# EAGLE schematic fyp (EAGLE 8.2.0)
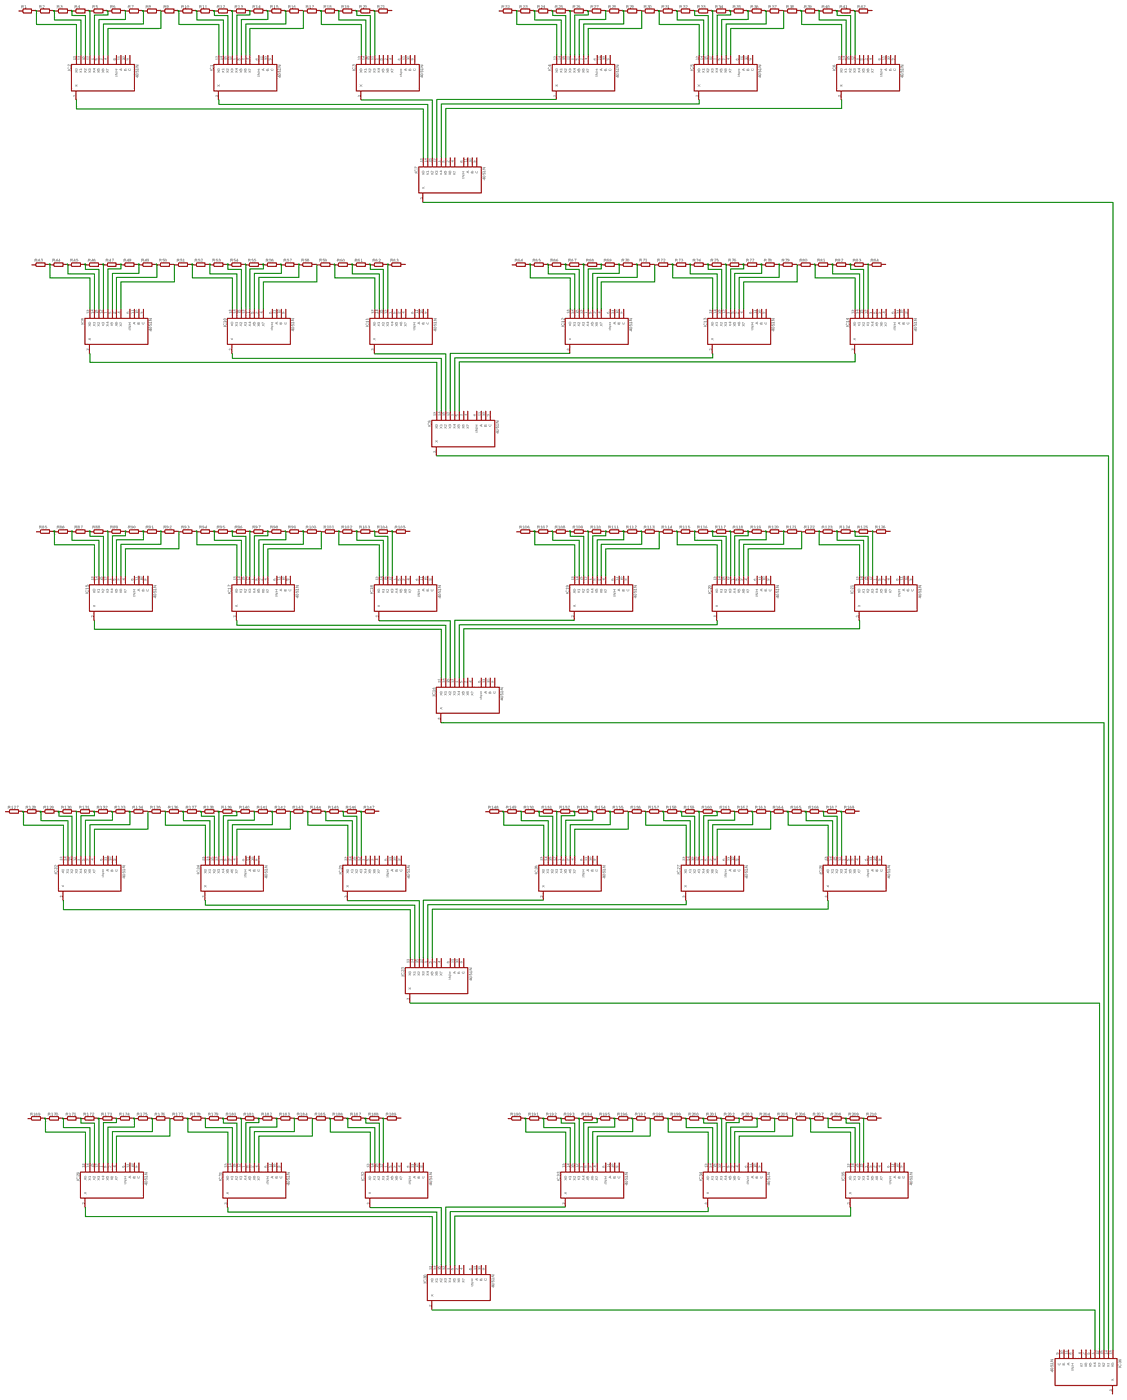
[diagram p0: schematic, sheet 1, overview]
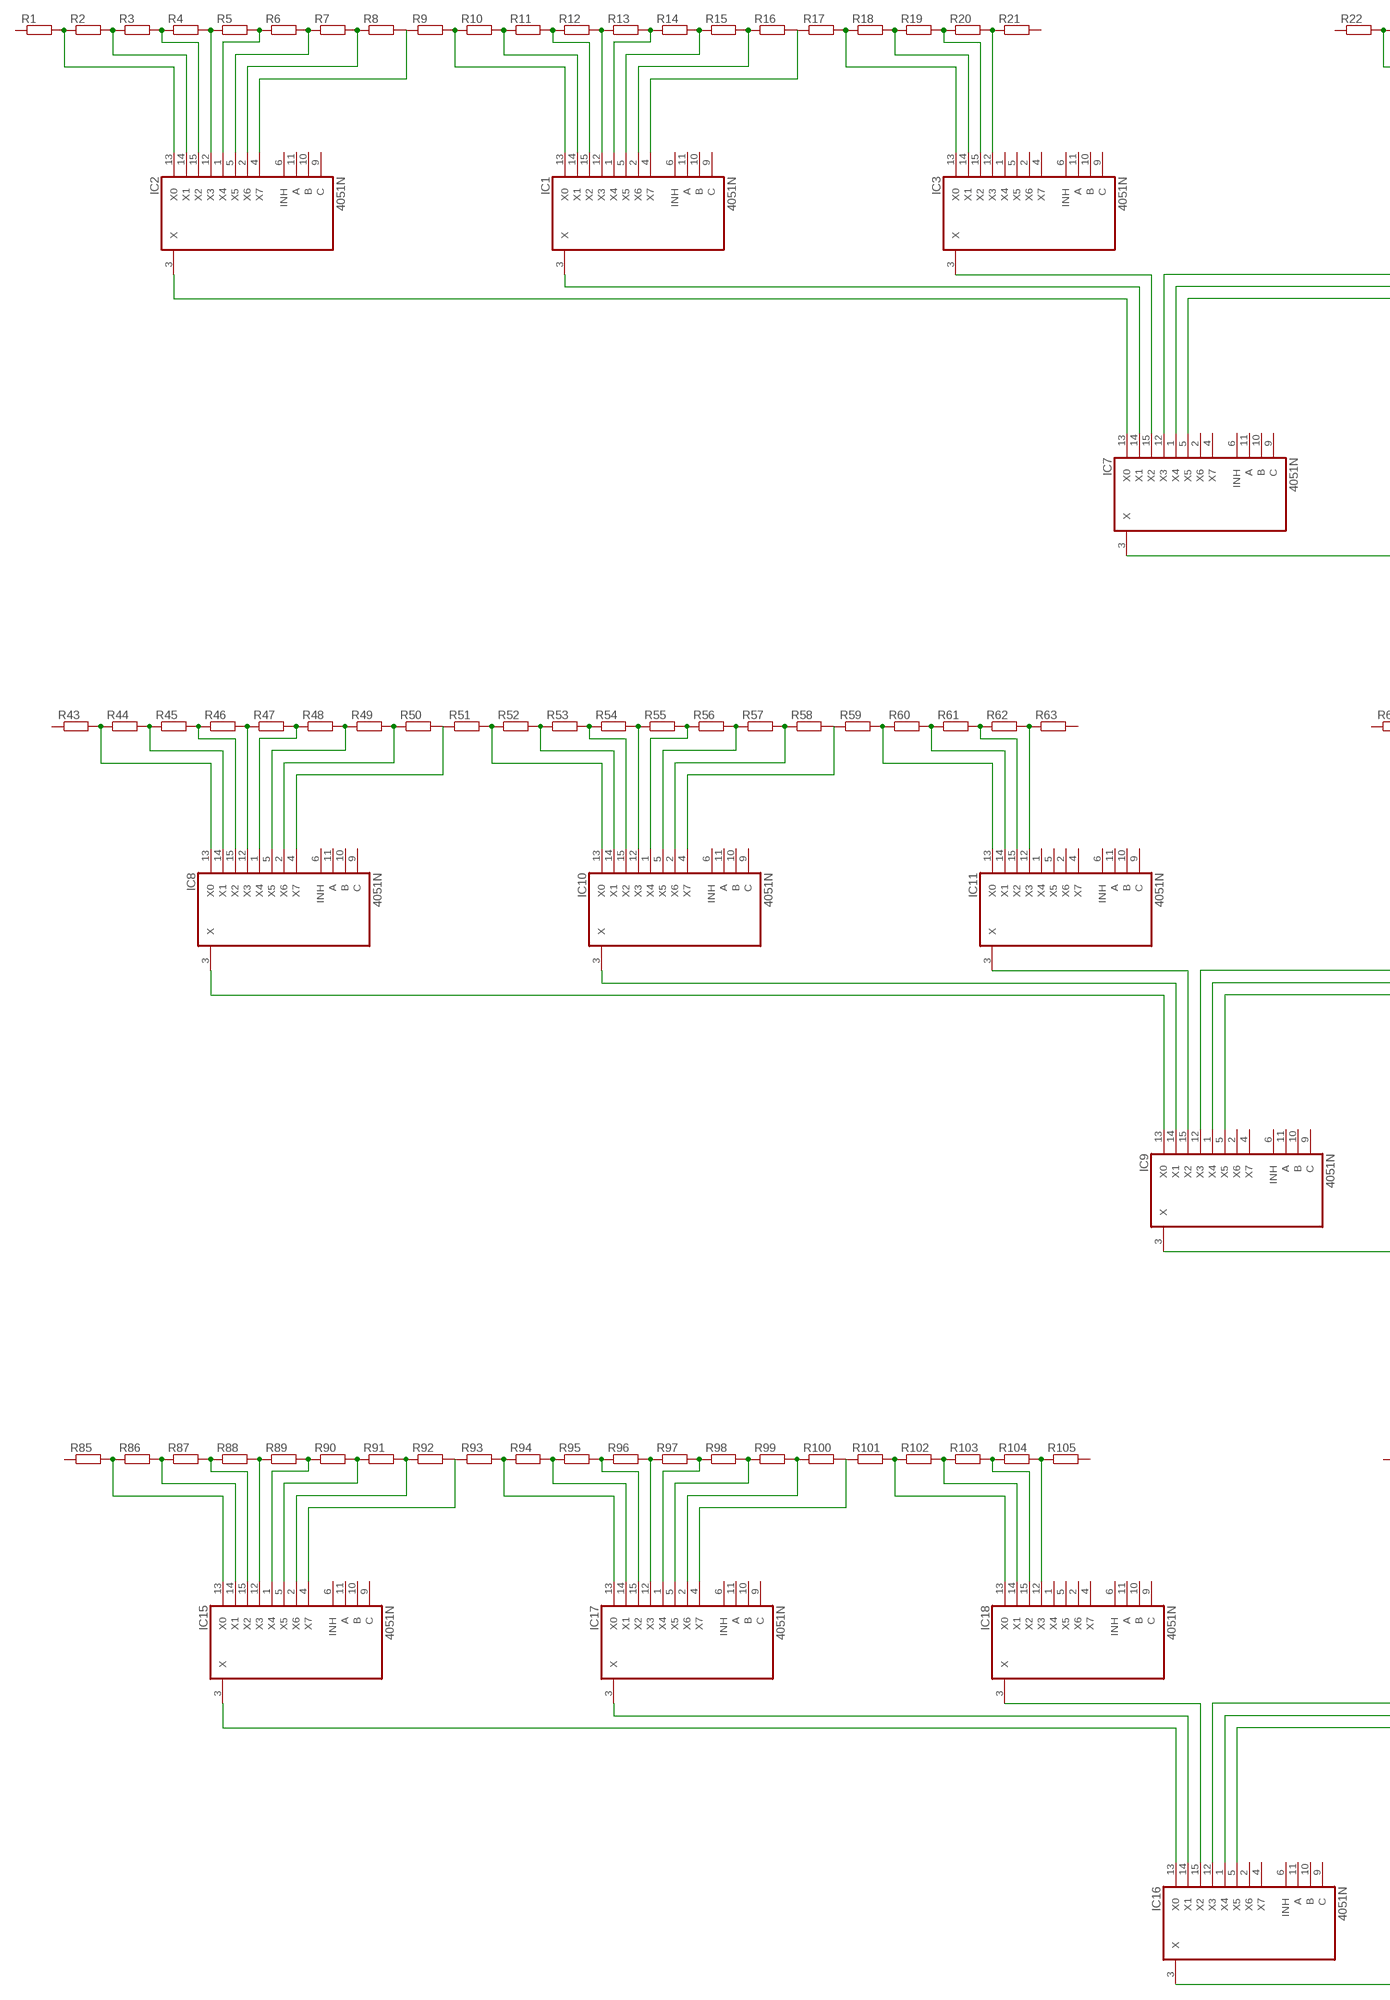
[diagram p1: schematic, sheet 1, part 1 of 4]
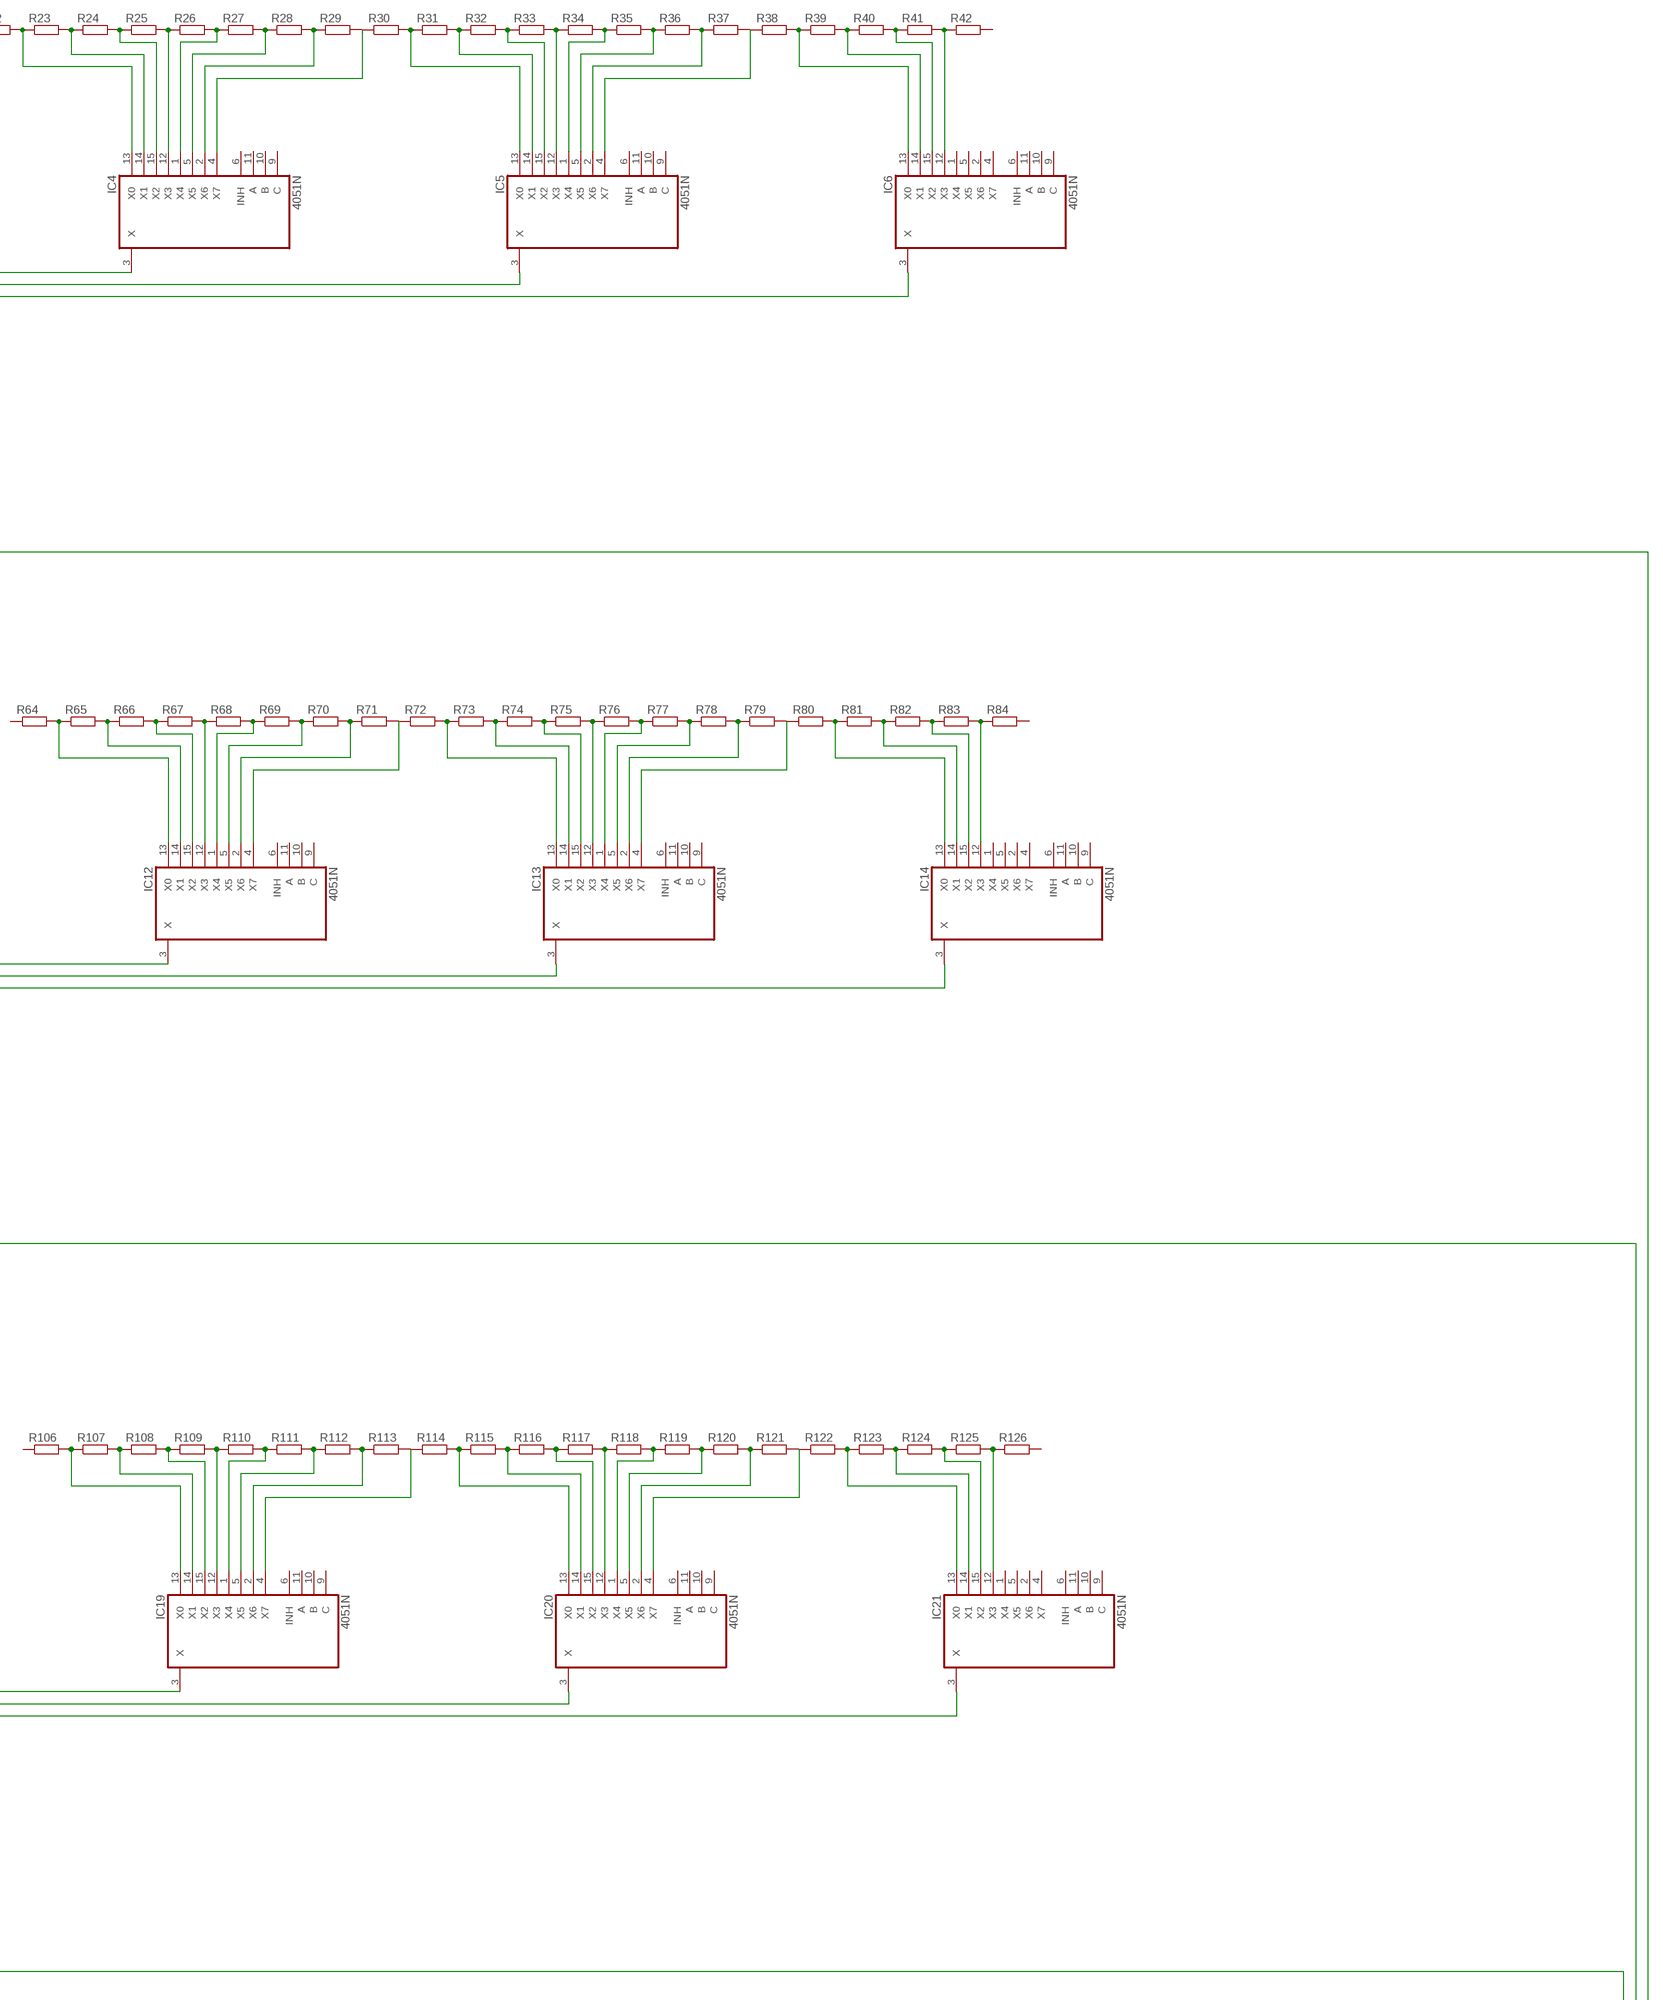
[diagram p2: schematic, sheet 1, part 2 of 4]
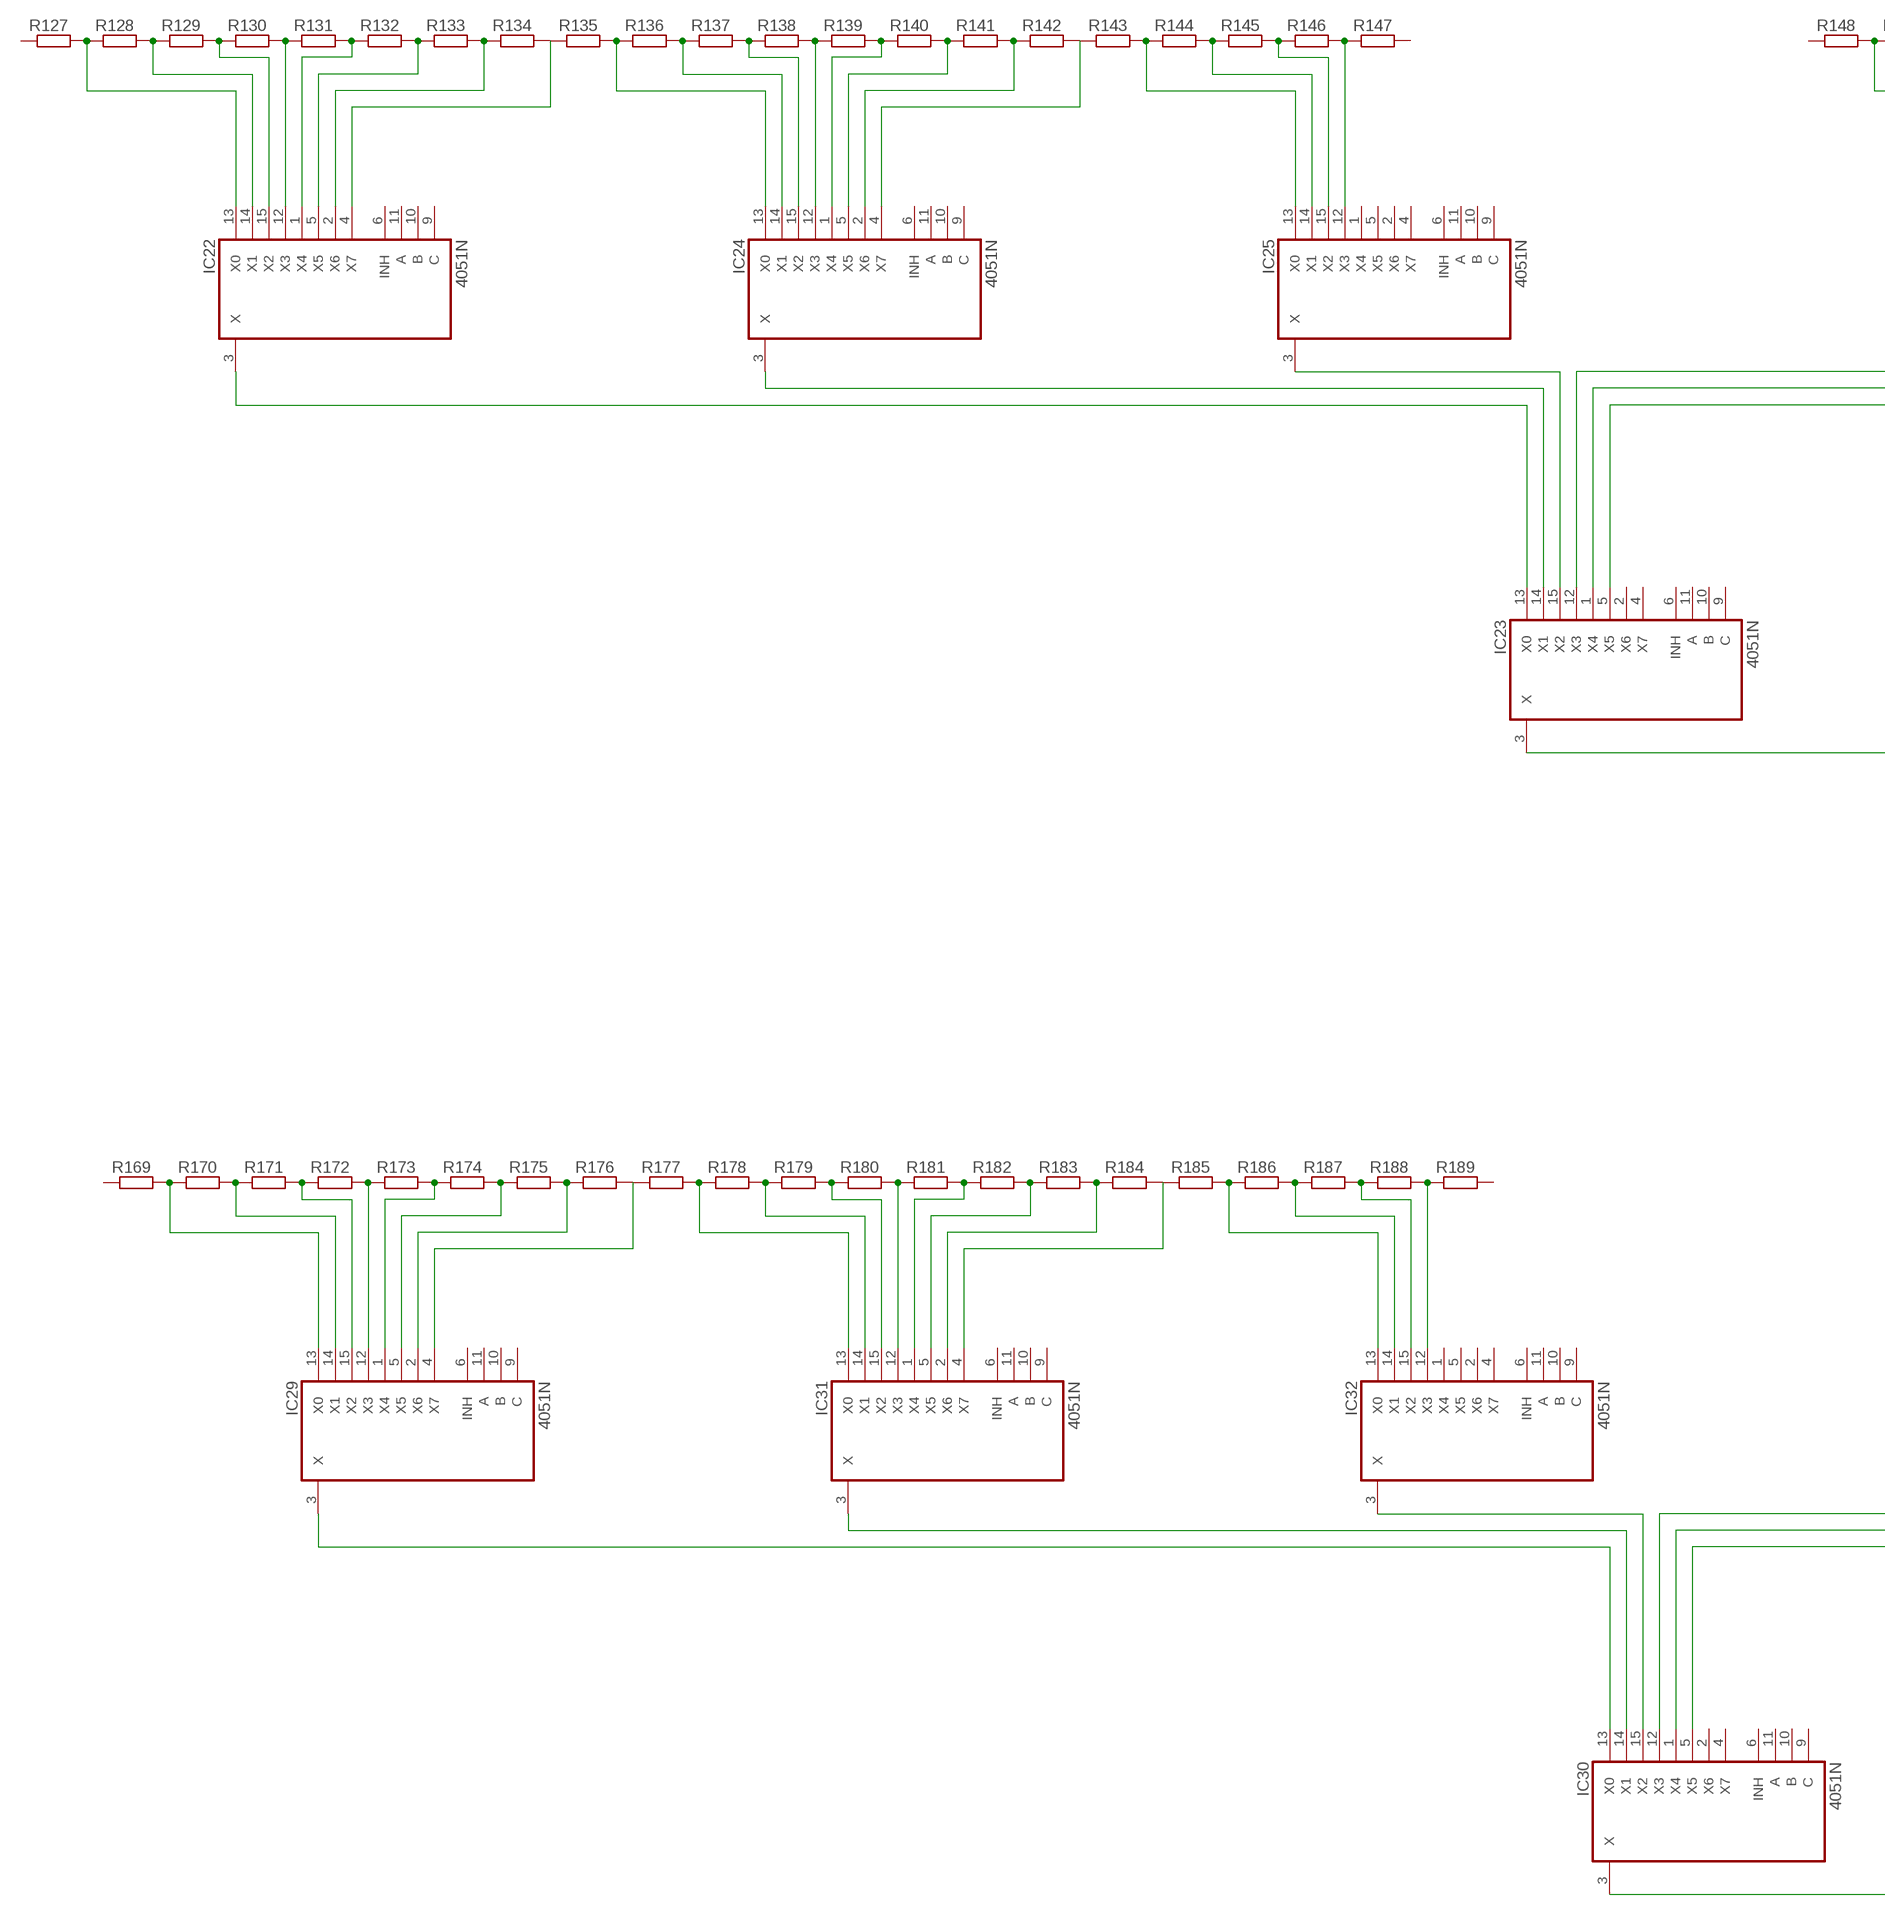
[diagram p3: schematic, sheet 1, part 3 of 4]
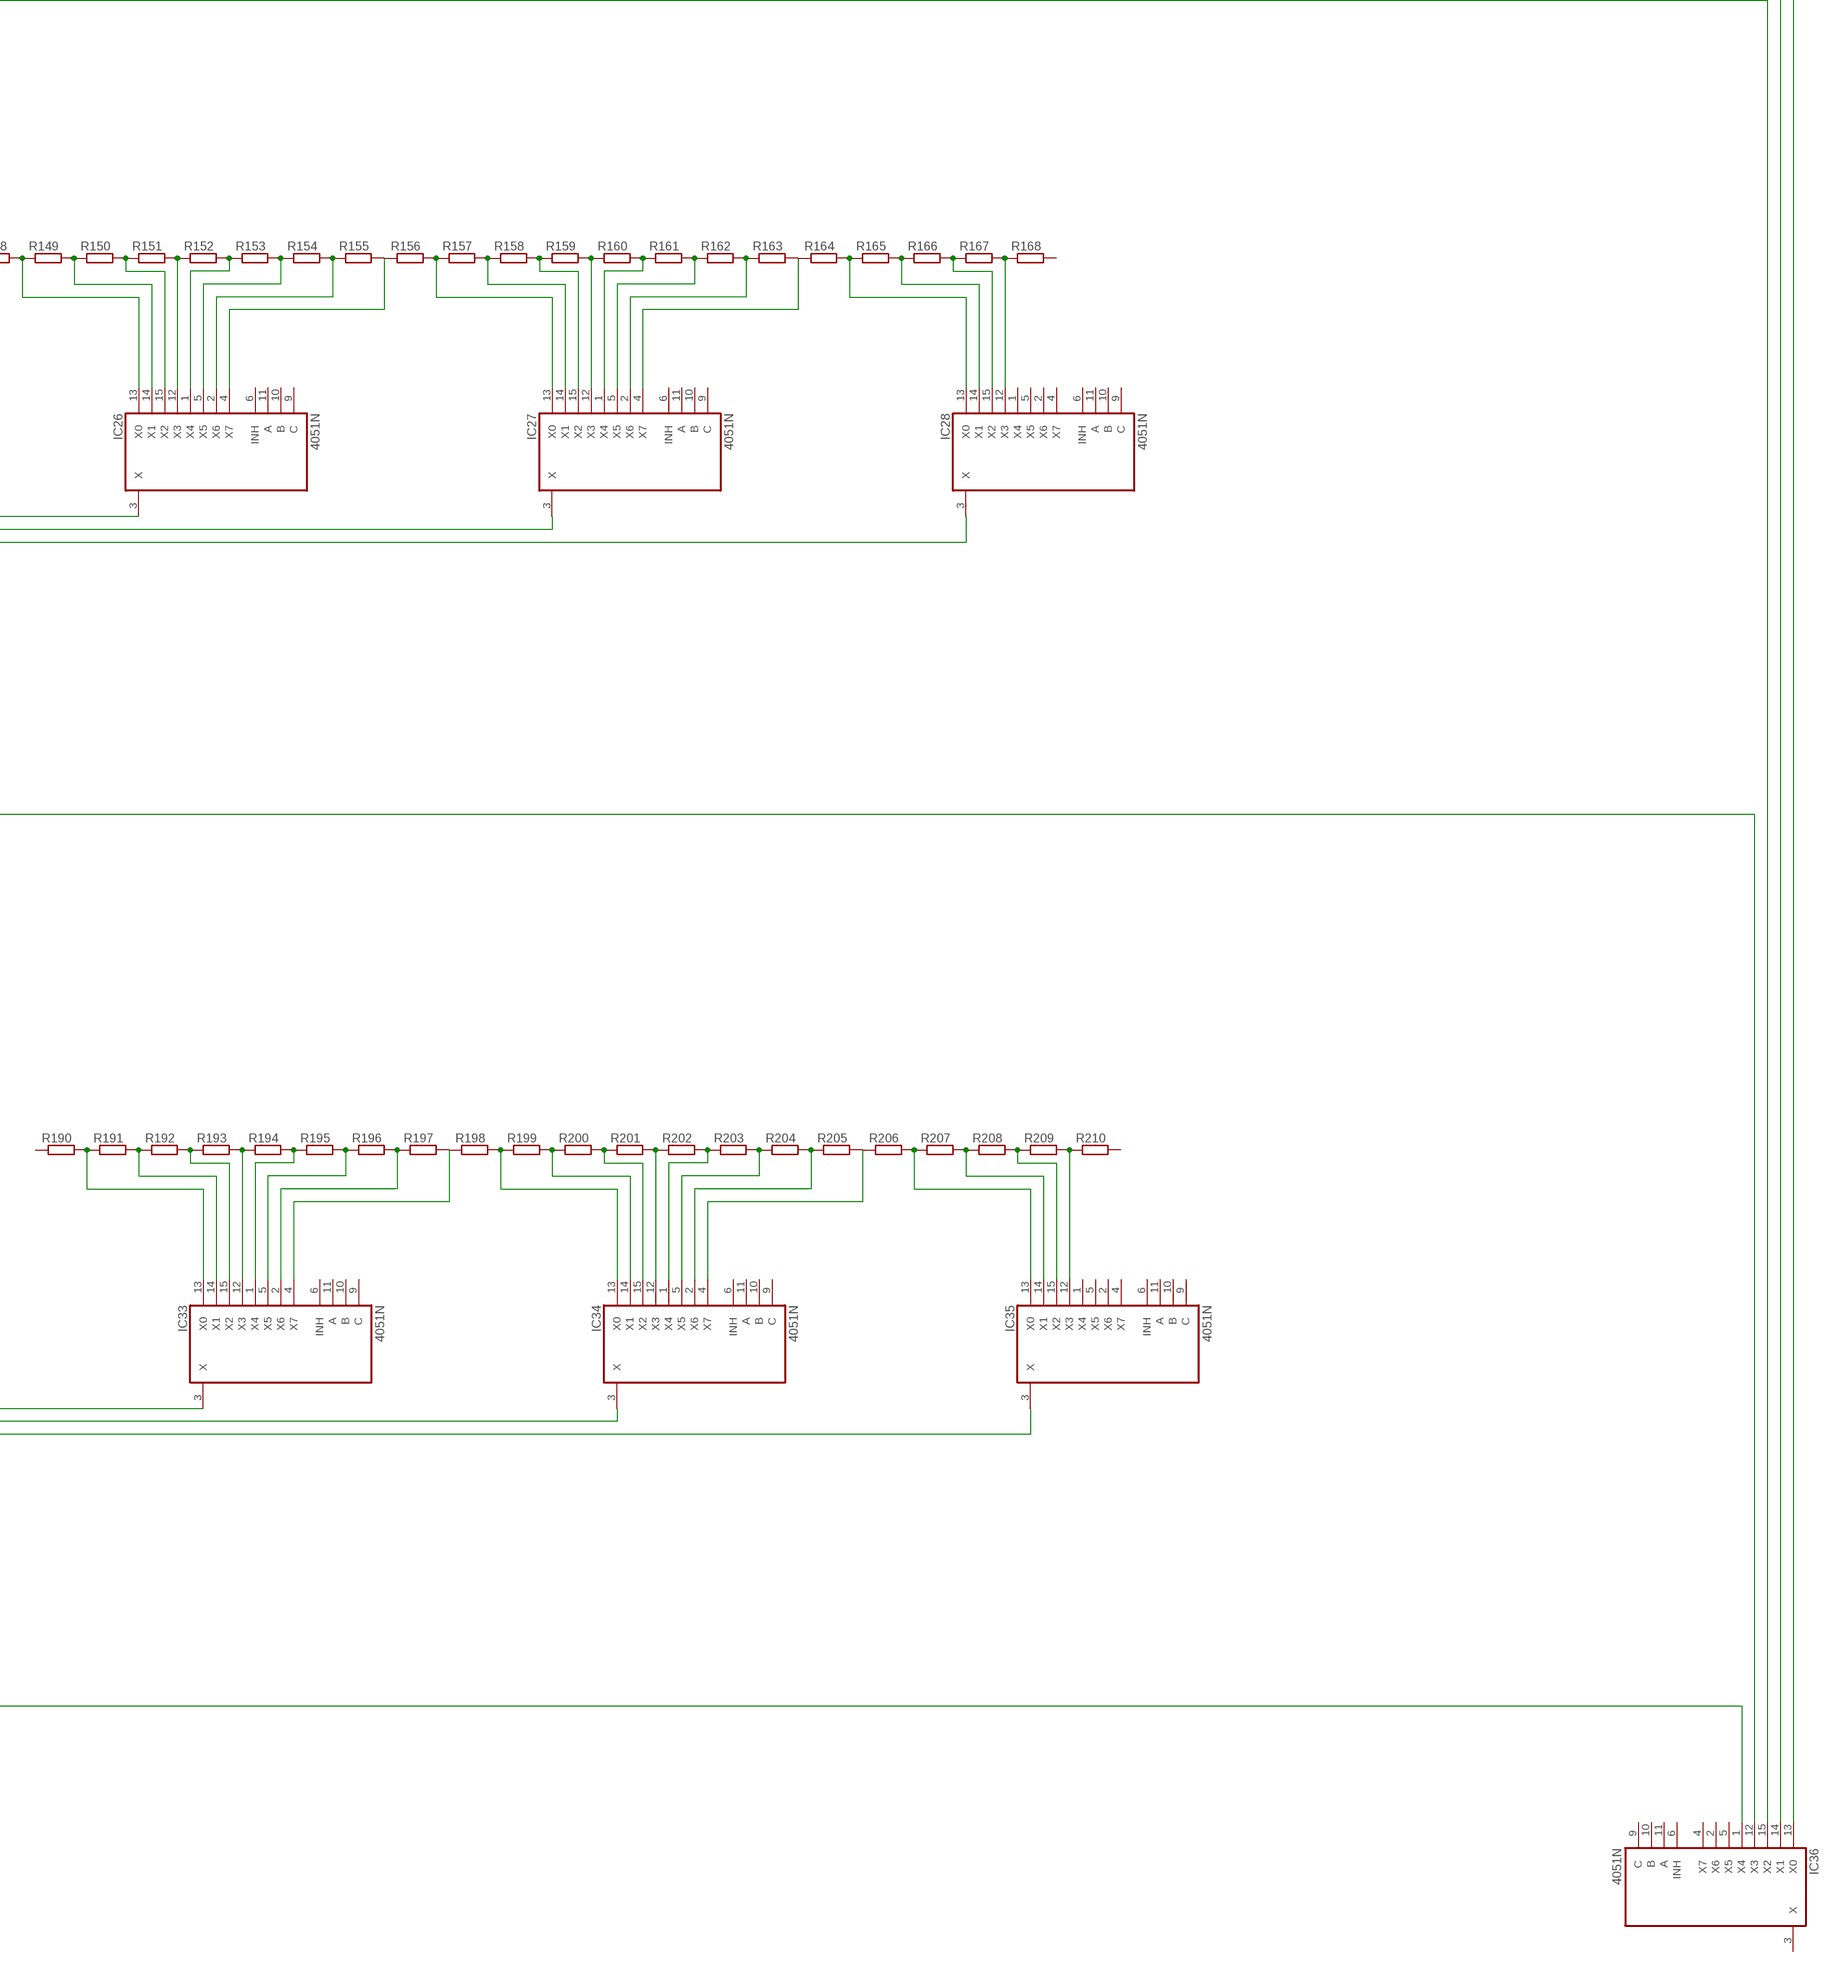
[diagram p4: schematic, sheet 1, part 4 of 4]

## Parts
IC1  4051N  [DIL16]
IC2  4051N  [DIL16]
IC3  4051N  [DIL16]
IC4  4051N  [DIL16]
IC5  4051N  [DIL16]
IC6  4051N  [DIL16]
IC7  4051N  [DIL16]
IC8  4051N  [DIL16]
IC9  4051N  [DIL16]
IC10  4051N  [DIL16]
IC11  4051N  [DIL16]
IC12  4051N  [DIL16]
IC13  4051N  [DIL16]
IC14  4051N  [DIL16]
IC15  4051N  [DIL16]
IC16  4051N  [DIL16]
IC17  4051N  [DIL16]
IC18  4051N  [DIL16]
IC19  4051N  [DIL16]
IC20  4051N  [DIL16]
IC21  4051N  [DIL16]
IC22  4051N  [DIL16]
IC23  4051N  [DIL16]
IC24  4051N  [DIL16]
IC25  4051N  [DIL16]
IC26  4051N  [DIL16]
IC27  4051N  [DIL16]
IC28  4051N  [DIL16]
IC29  4051N  [DIL16]
IC30  4051N  [DIL16]
IC31  4051N  [DIL16]
IC32  4051N  [DIL16]
IC33  4051N  [DIL16]
IC34  4051N  [DIL16]
IC35  4051N  [DIL16]
IC36  4051N  [DIL16]
R1  R-EU_0204/2V  [0204V]
R2  R-EU_0204/2V  [0204V]
R3  R-EU_0204/2V  [0204V]
R4  R-EU_0204/2V  [0204V]
R5  R-EU_0204/2V  [0204V]
R6  R-EU_0204/2V  [0204V]
R7  R-EU_0204/2V  [0204V]
R8  R-EU_0204/2V  [0204V]
R9  R-EU_0204/2V  [0204V]
R10  R-EU_0204/2V  [0204V]
R11  R-EU_0204/2V  [0204V]
R12  R-EU_0204/2V  [0204V]
R13  R-EU_0204/2V  [0204V]
R14  R-EU_0204/2V  [0204V]
R15  R-EU_0204/2V  [0204V]
R16  R-EU_0204/2V  [0204V]
R17  R-EU_0204/2V  [0204V]
R18  R-EU_0204/2V  [0204V]
R19  R-EU_0204/2V  [0204V]
R20  R-EU_0204/2V  [0204V]
R21  R-EU_0204/2V  [0204V]
R22  R-EU_0204/2V  [0204V]
R23  R-EU_0204/2V  [0204V]
R24  R-EU_0204/2V  [0204V]
R25  R-EU_0204/2V  [0204V]
R26  R-EU_0204/2V  [0204V]
R27  R-EU_0204/2V  [0204V]
R28  R-EU_0204/2V  [0204V]
R29  R-EU_0204/2V  [0204V]
R30  R-EU_0204/2V  [0204V]
R31  R-EU_0204/2V  [0204V]
R32  R-EU_0204/2V  [0204V]
R33  R-EU_0204/2V  [0204V]
R34  R-EU_0204/2V  [0204V]
R35  R-EU_0204/2V  [0204V]
R36  R-EU_0204/2V  [0204V]
R37  R-EU_0204/2V  [0204V]
R38  R-EU_0204/2V  [0204V]
R39  R-EU_0204/2V  [0204V]
R40  R-EU_0204/2V  [0204V]
R41  R-EU_0204/2V  [0204V]
R42  R-EU_0204/2V  [0204V]
R43  R-EU_0204/2V  [0204V]
R44  R-EU_0204/2V  [0204V]
R45  R-EU_0204/2V  [0204V]
R46  R-EU_0204/2V  [0204V]
R47  R-EU_0204/2V  [0204V]
R48  R-EU_0204/2V  [0204V]
R49  R-EU_0204/2V  [0204V]
R50  R-EU_0204/2V  [0204V]
R51  R-EU_0204/2V  [0204V]
R52  R-EU_0204/2V  [0204V]
R53  R-EU_0204/2V  [0204V]
R54  R-EU_0204/2V  [0204V]
R55  R-EU_0204/2V  [0204V]
R56  R-EU_0204/2V  [0204V]
R57  R-EU_0204/2V  [0204V]
R58  R-EU_0204/2V  [0204V]
R59  R-EU_0204/2V  [0204V]
R60  R-EU_0204/2V  [0204V]
R61  R-EU_0204/2V  [0204V]
R62  R-EU_0204/2V  [0204V]
R63  R-EU_0204/2V  [0204V]
R64  R-EU_0204/2V  [0204V]
R65  R-EU_0204/2V  [0204V]
R66  R-EU_0204/2V  [0204V]
R67  R-EU_0204/2V  [0204V]
R68  R-EU_0204/2V  [0204V]
R69  R-EU_0204/2V  [0204V]
R70  R-EU_0204/2V  [0204V]
R71  R-EU_0204/2V  [0204V]
R72  R-EU_0204/2V  [0204V]
R73  R-EU_0204/2V  [0204V]
R74  R-EU_0204/2V  [0204V]
R75  R-EU_0204/2V  [0204V]
R76  R-EU_0204/2V  [0204V]
R77  R-EU_0204/2V  [0204V]
R78  R-EU_0204/2V  [0204V]
R79  R-EU_0204/2V  [0204V]
R80  R-EU_0204/2V  [0204V]
R81  R-EU_0204/2V  [0204V]
R82  R-EU_0204/2V  [0204V]
R83  R-EU_0204/2V  [0204V]
R84  R-EU_0204/2V  [0204V]
R85  R-EU_0204/2V  [0204V]
R86  R-EU_0204/2V  [0204V]
R87  R-EU_0204/2V  [0204V]
R88  R-EU_0204/2V  [0204V]
R89  R-EU_0204/2V  [0204V]
R90  R-EU_0204/2V  [0204V]
R91  R-EU_0204/2V  [0204V]
R92  R-EU_0204/2V  [0204V]
R93  R-EU_0204/2V  [0204V]
R94  R-EU_0204/2V  [0204V]
R95  R-EU_0204/2V  [0204V]
R96  R-EU_0204/2V  [0204V]
R97  R-EU_0204/2V  [0204V]
R98  R-EU_0204/2V  [0204V]
R99  R-EU_0204/2V  [0204V]
R100  R-EU_0204/2V  [0204V]
R101  R-EU_0204/2V  [0204V]
R102  R-EU_0204/2V  [0204V]
R103  R-EU_0204/2V  [0204V]
R104  R-EU_0204/2V  [0204V]
R105  R-EU_0204/2V  [0204V]
R106  R-EU_0204/2V  [0204V]
R107  R-EU_0204/2V  [0204V]
R108  R-EU_0204/2V  [0204V]
R109  R-EU_0204/2V  [0204V]
R110  R-EU_0204/2V  [0204V]
R111  R-EU_0204/2V  [0204V]
R112  R-EU_0204/2V  [0204V]
R113  R-EU_0204/2V  [0204V]
R114  R-EU_0204/2V  [0204V]
R115  R-EU_0204/2V  [0204V]
R116  R-EU_0204/2V  [0204V]
R117  R-EU_0204/2V  [0204V]
R118  R-EU_0204/2V  [0204V]
R119  R-EU_0204/2V  [0204V]
R120  R-EU_0204/2V  [0204V]
R121  R-EU_0204/2V  [0204V]
R122  R-EU_0204/2V  [0204V]
R123  R-EU_0204/2V  [0204V]
R124  R-EU_0204/2V  [0204V]
R125  R-EU_0204/2V  [0204V]
R126  R-EU_0204/2V  [0204V]
R127  R-EU_0204/2V  [0204V]
R128  R-EU_0204/2V  [0204V]
R129  R-EU_0204/2V  [0204V]
R130  R-EU_0204/2V  [0204V]
R131  R-EU_0204/2V  [0204V]
R132  R-EU_0204/2V  [0204V]
R133  R-EU_0204/2V  [0204V]
R134  R-EU_0204/2V  [0204V]
R135  R-EU_0204/2V  [0204V]
R136  R-EU_0204/2V  [0204V]
R137  R-EU_0204/2V  [0204V]
R138  R-EU_0204/2V  [0204V]
R139  R-EU_0204/2V  [0204V]
R140  R-EU_0204/2V  [0204V]
R141  R-EU_0204/2V  [0204V]
R142  R-EU_0204/2V  [0204V]
R143  R-EU_0204/2V  [0204V]
R144  R-EU_0204/2V  [0204V]
R145  R-EU_0204/2V  [0204V]
R146  R-EU_0204/2V  [0204V]
R147  R-EU_0204/2V  [0204V]
R148  R-EU_0204/2V  [0204V]
R149  R-EU_0204/2V  [0204V]
R150  R-EU_0204/2V  [0204V]
R151  R-EU_0204/2V  [0204V]
R152  R-EU_0204/2V  [0204V]
R153  R-EU_0204/2V  [0204V]
R154  R-EU_0204/2V  [0204V]
R155  R-EU_0204/2V  [0204V]
R156  R-EU_0204/2V  [0204V]
R157  R-EU_0204/2V  [0204V]
R158  R-EU_0204/2V  [0204V]
R159  R-EU_0204/2V  [0204V]
R160  R-EU_0204/2V  [0204V]
R161  R-EU_0204/2V  [0204V]
R162  R-EU_0204/2V  [0204V]
R163  R-EU_0204/2V  [0204V]
R164  R-EU_0204/2V  [0204V]
R165  R-EU_0204/2V  [0204V]
R166  R-EU_0204/2V  [0204V]
R167  R-EU_0204/2V  [0204V]
R168  R-EU_0204/2V  [0204V]
R169  R-EU_0204/2V  [0204V]
R170  R-EU_0204/2V  [0204V]
R171  R-EU_0204/2V  [0204V]
R172  R-EU_0204/2V  [0204V]
R173  R-EU_0204/2V  [0204V]
R174  R-EU_0204/2V  [0204V]
R175  R-EU_0204/2V  [0204V]
R176  R-EU_0204/2V  [0204V]
R177  R-EU_0204/2V  [0204V]
R178  R-EU_0204/2V  [0204V]
R179  R-EU_0204/2V  [0204V]
R180  R-EU_0204/2V  [0204V]
R181  R-EU_0204/2V  [0204V]
R182  R-EU_0204/2V  [0204V]
R183  R-EU_0204/2V  [0204V]
R184  R-EU_0204/2V  [0204V]
R185  R-EU_0204/2V  [0204V]
R186  R-EU_0204/2V  [0204V]
R187  R-EU_0204/2V  [0204V]
R188  R-EU_0204/2V  [0204V]
R189  R-EU_0204/2V  [0204V]
R190  R-EU_0204/2V  [0204V]
R191  R-EU_0204/2V  [0204V]
R192  R-EU_0204/2V  [0204V]
R193  R-EU_0204/2V  [0204V]
R194  R-EU_0204/2V  [0204V]
R195  R-EU_0204/2V  [0204V]
R196  R-EU_0204/2V  [0204V]
R197  R-EU_0204/2V  [0204V]
R198  R-EU_0204/2V  [0204V]
R199  R-EU_0204/2V  [0204V]
R200  R-EU_0204/2V  [0204V]
R201  R-EU_0204/2V  [0204V]
R202  R-EU_0204/2V  [0204V]
R203  R-EU_0204/2V  [0204V]
R204  R-EU_0204/2V  [0204V]
R205  R-EU_0204/2V  [0204V]
R206  R-EU_0204/2V  [0204V]
R207  R-EU_0204/2V  [0204V]
R208  R-EU_0204/2V  [0204V]
R209  R-EU_0204/2V  [0204V]
R210  R-EU_0204/2V  [0204V]

## Nets
N$1: IC2.13(X0) R1.2 R2.1
N$2: IC2.14(X1) R2.2 R3.1
N$3: IC2.15(X2) R3.2 R4.1
N$4: IC2.12(X3) R4.2 R5.1
N$5: IC2.1(X4) R5.2 R6.1
N$6: IC2.5(X5) R6.2 R7.1
N$7: IC2.2(X6) R7.2 R8.1
N$8: IC2.4(X7) R8.2
N$9: IC1.13(X0) R9.2 R10.1
N$10: IC1.14(X1) R10.2 R11.1
N$11: IC1.15(X2) R11.2 R12.1
N$12: IC1.12(X3) R12.2 R13.1
N$13: IC1.1(X4) R13.2 R14.1
N$14: IC1.5(X5) R14.2 R15.1
N$15: IC1.2(X6) R15.2 R16.1
N$16: IC1.4(X7) R16.2
N$17: IC3.13(X0) R17.2 R18.1
N$18: IC3.14(X1) R18.2 R19.1
N$19: IC3.15(X2) R19.2 R20.1
N$20: IC4.13(X0) R22.2 R23.1
N$21: IC4.14(X1) R23.2 R24.1
N$22: IC4.15(X2) R24.2 R25.1
N$23: IC4.12(X3) R25.2 R26.1
N$24: IC4.1(X4) R26.2 R27.1
N$25: IC4.5(X5) R27.2 R28.1
N$26: IC4.2(X6) R28.2 R29.1
N$27: IC4.4(X7) R29.2
N$28: IC5.13(X0) R30.2 R31.1
N$29: IC5.14(X1) R31.2 R32.1
N$30: IC5.15(X2) R32.2 R33.1
N$31: IC5.12(X3) R33.2 R34.1
N$32: IC5.1(X4) R34.2 R35.1
N$33: IC5.5(X5) R35.2 R36.1
N$34: IC5.2(X6) R36.2 R37.1
N$35: IC5.4(X7) R37.2
N$36: IC6.13(X0) R38.2 R39.1
N$37: IC6.14(X1) R39.2 R40.1
N$38: IC6.15(X2) R40.2 R41.1
N$39: IC3.12(X3) R20.2 R21.1
N$40: IC6.12(X3) R41.2 R42.1
N$41: IC3.3(X) IC7.15(X2)
N$42: IC1.3(X) IC7.14(X1)
N$43: IC2.3(X) IC7.13(X0)
N$44: IC4.3(X) IC7.12(X3)
N$45: IC5.3(X) IC7.1(X4)
N$46: IC6.3(X) IC7.5(X5)
N$47: IC8.13(X0) R43.2 R44.1
N$48: IC8.14(X1) R44.2 R45.1
N$49: IC8.15(X2) R45.2 R46.1
N$50: IC8.12(X3) R46.2 R47.1
N$51: IC8.1(X4) R47.2 R48.1
N$52: IC8.5(X5) R48.2 R49.1
N$53: IC8.2(X6) R49.2 R50.1
N$54: IC8.4(X7) R50.2
N$55: IC10.13(X0) R51.2 R52.1
N$56: IC10.14(X1) R52.2 R53.1
N$57: IC10.15(X2) R53.2 R54.1
N$58: IC10.12(X3) R54.2 R55.1
N$59: IC10.1(X4) R55.2 R56.1
N$60: IC10.5(X5) R56.2 R57.1
N$61: IC10.2(X6) R57.2 R58.1
N$62: IC10.4(X7) R58.2
N$63: IC11.13(X0) R59.2 R60.1
N$64: IC11.14(X1) R60.2 R61.1
N$65: IC11.15(X2) R61.2 R62.1
N$66: IC11.12(X3) R62.2 R63.1
N$67: IC12.13(X0) R64.2 R65.1
N$68: IC12.14(X1) R65.2 R66.1
N$69: IC12.15(X2) R66.2 R67.1
N$70: IC12.12(X3) R67.2 R68.1
N$71: IC12.1(X4) R68.2 R69.1
N$72: IC12.5(X5) R69.2 R70.1
N$73: IC12.2(X6) R70.2 R71.1
N$74: IC12.4(X7) R71.2
N$75: IC13.13(X0) R72.2 R73.1
N$76: IC13.14(X1) R73.2 R74.1
N$77: IC13.15(X2) R74.2 R75.1
N$78: IC13.12(X3) R75.2 R76.1
N$79: IC13.1(X4) R76.2 R77.1
N$80: IC13.5(X5) R77.2 R78.1
N$81: IC13.2(X6) R78.2 R79.1
N$82: IC13.4(X7) R79.2
N$83: IC14.13(X0) R80.2 R81.1
N$84: IC14.14(X1) R81.2 R82.1
N$85: IC14.15(X2) R82.2 R83.1
N$86: IC14.12(X3) R83.2 R84.1
N$87: IC9.15(X2) IC11.3(X)
N$88: IC9.14(X1) IC10.3(X)
N$89: IC8.3(X) IC9.13(X0)
N$90: IC9.12(X3) IC12.3(X)
N$91: IC9.1(X4) IC13.3(X)
N$92: IC9.5(X5) IC14.3(X)
N$93: IC15.13(X0) R85.2 R86.1
N$94: IC15.14(X1) R86.2 R87.1
N$95: IC15.15(X2) R87.2 R88.1
N$96: IC15.12(X3) R88.2 R89.1
N$97: IC15.1(X4) R89.2 R90.1
N$98: IC15.5(X5) R90.2 R91.1
N$99: IC15.2(X6) R91.2 R92.1
N$100: IC15.4(X7) R92.2
N$101: IC17.13(X0) R93.2 R94.1
N$102: IC17.14(X1) R94.2 R95.1
N$103: IC17.15(X2) R95.2 R96.1
N$104: IC17.12(X3) R96.2 R97.1
N$105: IC17.1(X4) R97.2 R98.1
N$106: IC17.5(X5) R98.2 R99.1
N$107: IC17.2(X6) R99.2 R100.1
N$108: IC17.4(X7) R100.2
N$109: IC18.13(X0) R101.2 R102.1
N$110: IC18.14(X1) R102.2 R103.1
N$111: IC18.15(X2) R103.2 R104.1
N$112: IC18.12(X3) R104.2 R105.1
N$113: IC19.13(X0) R106.2 R107.1
N$114: IC19.14(X1) R107.2 R108.1
N$115: IC19.15(X2) R108.2 R109.1
N$116: IC19.12(X3) R109.2 R110.1
N$117: IC19.1(X4) R110.2 R111.1
N$118: IC19.5(X5) R111.2 R112.1
N$119: IC19.2(X6) R112.2 R113.1
N$120: IC19.4(X7) R113.2
N$121: IC20.13(X0) R114.2 R115.1
N$122: IC20.14(X1) R115.2 R116.1
N$123: IC20.15(X2) R116.2 R117.1
N$124: IC20.12(X3) R117.2 R118.1
N$125: IC20.1(X4) R118.2 R119.1
N$126: IC20.5(X5) R119.2 R120.1
N$127: IC20.2(X6) R120.2 R121.1
N$128: IC20.4(X7) R121.2
N$129: IC21.13(X0) R122.2 R123.1
N$130: IC21.14(X1) R123.2 R124.1
N$131: IC21.15(X2) R124.2 R125.1
N$132: IC21.12(X3) R125.2 R126.1
N$133: IC16.15(X2) IC18.3(X)
N$134: IC16.14(X1) IC17.3(X)
N$135: IC15.3(X) IC16.13(X0)
N$136: IC16.12(X3) IC19.3(X)
N$137: IC16.1(X4) IC20.3(X)
N$138: IC16.5(X5) IC21.3(X)
N$139: IC22.13(X0) R127.2 R128.1
N$140: IC22.14(X1) R128.2 R129.1
N$141: IC22.15(X2) R129.2 R130.1
N$142: IC22.12(X3) R130.2 R131.1
N$143: IC22.1(X4) R131.2 R132.1
N$144: IC22.5(X5) R132.2 R133.1
N$145: IC22.2(X6) R133.2 R134.1
N$146: IC22.4(X7) R134.2
N$147: IC24.13(X0) R135.2 R136.1
N$148: IC24.14(X1) R136.2 R137.1
N$149: IC24.15(X2) R137.2 R138.1
N$150: IC24.12(X3) R138.2 R139.1
N$151: IC24.1(X4) R139.2 R140.1
N$152: IC24.5(X5) R140.2 R141.1
N$153: IC24.2(X6) R141.2 R142.1
N$154: IC24.4(X7) R142.2
N$155: IC25.13(X0) R143.2 R144.1
N$156: IC25.14(X1) R144.2 R145.1
N$157: IC25.15(X2) R145.2 R146.1
N$158: IC25.12(X3) R146.2 R147.1
N$159: IC26.13(X0) R148.2 R149.1
N$160: IC26.14(X1) R149.2 R150.1
N$161: IC26.15(X2) R150.2 R151.1
N$162: IC26.12(X3) R151.2 R152.1
N$163: IC26.1(X4) R152.2 R153.1
N$164: IC26.5(X5) R153.2 R154.1
N$165: IC26.2(X6) R154.2 R155.1
N$166: IC26.4(X7) R155.2
N$167: IC27.13(X0) R156.2 R157.1
N$168: IC27.14(X1) R157.2 R158.1
N$169: IC27.15(X2) R158.2 R159.1
N$170: IC27.12(X3) R159.2 R160.1
N$171: IC27.1(X4) R160.2 R161.1
N$172: IC27.5(X5) R161.2 R162.1
N$173: IC27.2(X6) R162.2 R163.1
N$174: IC27.4(X7) R163.2
N$175: IC28.13(X0) R164.2 R165.1
N$176: IC28.14(X1) R165.2 R166.1
N$177: IC28.15(X2) R166.2 R167.1
N$178: IC28.12(X3) R167.2 R168.1
N$179: IC23.15(X2) IC25.3(X)
N$180: IC23.14(X1) IC24.3(X)
N$181: IC22.3(X) IC23.13(X0)
N$182: IC23.12(X3) IC26.3(X)
N$183: IC23.1(X4) IC27.3(X)
N$184: IC23.5(X5) IC28.3(X)
N$185: IC29.13(X0) R169.2 R170.1
N$186: IC29.14(X1) R170.2 R171.1
N$187: IC29.15(X2) R171.2 R172.1
N$188: IC29.12(X3) R172.2 R173.1
N$189: IC29.1(X4) R173.2 R174.1
N$190: IC29.5(X5) R174.2 R175.1
N$191: IC29.2(X6) R175.2 R176.1
N$192: IC29.4(X7) R176.2
N$193: IC31.13(X0) R177.2 R178.1
N$194: IC31.14(X1) R178.2 R179.1
N$195: IC31.15(X2) R179.2 R180.1
N$196: IC31.12(X3) R180.2 R181.1
N$197: IC31.1(X4) R181.2 R182.1
N$198: IC31.5(X5) R182.2 R183.1
N$199: IC31.2(X6) R183.2 R184.1
N$200: IC31.4(X7) R184.2
N$201: IC32.13(X0) R185.2 R186.1
N$202: IC32.14(X1) R186.2 R187.1
N$203: IC32.15(X2) R187.2 R188.1
N$204: IC32.12(X3) R188.2 R189.1
N$205: IC33.13(X0) R190.2 R191.1
N$206: IC33.14(X1) R191.2 R192.1
N$207: IC33.15(X2) R192.2 R193.1
N$208: IC33.12(X3) R193.2 R194.1
N$209: IC33.1(X4) R194.2 R195.1
N$210: IC33.5(X5) R195.2 R196.1
N$211: IC33.2(X6) R196.2 R197.1
N$212: IC33.4(X7) R197.2
N$213: IC34.13(X0) R198.2 R199.1
N$214: IC34.14(X1) R199.2 R200.1
N$215: IC34.15(X2) R200.2 R201.1
N$216: IC34.12(X3) R201.2 R202.1
N$217: IC34.1(X4) R202.2 R203.1
N$218: IC34.5(X5) R203.2 R204.1
N$219: IC34.2(X6) R204.2 R205.1
N$220: IC34.4(X7) R205.2
N$221: IC35.13(X0) R206.2 R207.1
N$222: IC35.14(X1) R207.2 R208.1
N$223: IC35.15(X2) R208.2 R209.1
N$224: IC35.12(X3) R209.2 R210.1
N$225: IC30.15(X2) IC32.3(X)
N$226: IC30.14(X1) IC31.3(X)
N$227: IC29.3(X) IC30.13(X0)
N$228: IC30.12(X3) IC33.3(X)
N$229: IC30.1(X4) IC34.3(X)
N$230: IC30.5(X5) IC35.3(X)
N$231: IC7.3(X) IC36.13(X0)
N$232: IC9.3(X) IC36.14(X1)
N$233: IC16.3(X) IC36.15(X2)
N$234: IC23.3(X) IC36.12(X3)
N$235: IC30.3(X) IC36.1(X4)
Unconnected: IC1.6(INH) IC1.9(C) IC1.10(B) IC1.11(A) IC2.6(INH) IC2.9(C) IC2.10(B) IC2.11(A) IC3.1(X4) IC3.2(X6) IC3.4(X7) IC3.5(X5) IC3.6(INH) IC3.9(C) IC3.10(B) IC3.11(A) IC4.6(INH) IC4.9(C) IC4.10(B) IC4.11(A) IC5.6(INH) IC5.9(C) IC5.10(B) IC5.11(A) IC6.1(X4) IC6.2(X6) IC6.4(X7) IC6.5(X5) IC6.6(INH) IC6.9(C) IC6.10(B) IC6.11(A) IC7.2(X6) IC7.4(X7) IC7.6(INH) IC7.9(C) IC7.10(B) IC7.11(A) IC8.6(INH) IC8.9(C) IC8.10(B) IC8.11(A) IC9.2(X6) IC9.4(X7) IC9.6(INH) IC9.9(C) IC9.10(B) IC9.11(A) IC10.6(INH) IC10.9(C) IC10.10(B) IC10.11(A) IC11.1(X4) IC11.2(X6) IC11.4(X7) IC11.5(X5) IC11.6(INH) IC11.9(C) IC11.10(B) IC11.11(A) IC12.6(INH) IC12.9(C) IC12.10(B) IC12.11(A) IC13.6(INH) IC13.9(C) IC13.10(B) IC13.11(A) IC14.1(X4) IC14.2(X6) IC14.4(X7) IC14.5(X5) IC14.6(INH) IC14.9(C) IC14.10(B) IC14.11(A) IC15.6(INH) IC15.9(C) IC15.10(B) IC15.11(A) IC16.2(X6) IC16.4(X7) IC16.6(INH) IC16.9(C) IC16.10(B) IC16.11(A) IC17.6(INH) IC17.9(C) IC17.10(B) IC17.11(A) IC18.1(X4) IC18.2(X6) IC18.4(X7) IC18.5(X5) IC18.6(INH) IC18.9(C) IC18.10(B) IC18.11(A) IC19.6(INH) IC19.9(C) IC19.10(B) IC19.11(A) IC20.6(INH) IC20.9(C) IC20.10(B) IC20.11(A) IC21.1(X4) IC21.2(X6) IC21.4(X7) IC21.5(X5) IC21.6(INH) IC21.9(C) IC21.10(B) IC21.11(A) IC22.6(INH) IC22.9(C) IC22.10(B) IC22.11(A) IC23.2(X6) IC23.4(X7) IC23.6(INH) IC23.9(C) IC23.10(B) IC23.11(A) IC24.6(INH) IC24.9(C) IC24.10(B) IC24.11(A) IC25.1(X4) IC25.2(X6) IC25.4(X7) IC25.5(X5) IC25.6(INH) IC25.9(C) IC25.10(B) IC25.11(A) IC26.6(INH) IC26.9(C) IC26.10(B) IC26.11(A) IC27.6(INH) IC27.9(C) IC27.10(B) IC27.11(A) IC28.1(X4) IC28.2(X6) IC28.4(X7) IC28.5(X5) IC28.6(INH) IC28.9(C) IC28.10(B) IC28.11(A) IC29.6(INH) IC29.9(C) IC29.10(B) IC29.11(A) IC30.2(X6) IC30.4(X7) IC30.6(INH) IC30.9(C) IC30.10(B) IC30.11(A) IC31.6(INH) IC31.9(C) IC31.10(B) IC31.11(A) IC32.1(X4) IC32.2(X6) IC32.4(X7) IC32.5(X5) IC32.6(INH) IC32.9(C) IC32.10(B) IC32.11(A) IC33.6(INH) IC33.9(C) IC33.10(B) IC33.11(A) IC34.6(INH) IC34.9(C) IC34.10(B) IC34.11(A) IC35.1(X4) IC35.2(X6) IC35.4(X7) IC35.5(X5) IC35.6(INH) IC35.9(C) IC35.10(B) IC35.11(A) IC36.2(X6) IC36.3(X) IC36.4(X7) IC36.5(X5) IC36.6(INH) IC36.9(C) IC36.10(B) IC36.11(A) R1.1 R9.1 R17.1 R21.2 R22.1 R30.1 R38.1 R42.2 R43.1 R51.1 R59.1 R63.2 R64.1 R72.1 R80.1 R84.2 R85.1 R93.1 R101.1 R105.2 R106.1 R114.1 R122.1 R126.2 R127.1 R135.1 R143.1 R147.2 R148.1 R156.1 R164.1 R168.2 R169.1 R177.1 R185.1 R189.2 R190.1 R198.1 R206.1 R210.2

## Power pins joined to a net without a drawn wire
GND: IC1.8(GND) IC2.8(GND) IC3.8(GND) IC4.8(GND) IC5.8(GND) IC6.8(GND) IC7.8(GND) IC8.8(GND) IC9.8(GND) IC10.8(GND) IC11.8(GND) IC12.8(GND) IC13.8(GND) IC14.8(GND) IC15.8(GND) IC16.8(GND) IC17.8(GND) IC18.8(GND) IC19.8(GND) IC20.8(GND) IC21.8(GND) IC22.8(GND) IC23.8(GND) IC24.8(GND) IC25.8(GND) IC26.8(GND) IC27.8(GND) IC28.8(GND) IC29.8(GND) IC30.8(GND) IC31.8(GND) IC32.8(GND) IC33.8(GND) IC34.8(GND) IC35.8(GND) IC36.8(GND)
VCC: IC1.16(VCC) IC2.16(VCC) IC3.16(VCC) IC4.16(VCC) IC5.16(VCC) IC6.16(VCC) IC7.16(VCC) IC8.16(VCC) IC9.16(VCC) IC10.16(VCC) IC11.16(VCC) IC12.16(VCC) IC13.16(VCC) IC14.16(VCC) IC15.16(VCC) IC16.16(VCC) IC17.16(VCC) IC18.16(VCC) IC19.16(VCC) IC20.16(VCC) IC21.16(VCC) IC22.16(VCC) IC23.16(VCC) IC24.16(VCC) IC25.16(VCC) IC26.16(VCC) IC27.16(VCC) IC28.16(VCC) IC29.16(VCC) IC30.16(VCC) IC31.16(VCC) IC32.16(VCC) IC33.16(VCC) IC34.16(VCC) IC35.16(VCC) IC36.16(VCC)
VEE: IC1.7(VEE) IC2.7(VEE) IC3.7(VEE) IC4.7(VEE) IC5.7(VEE) IC6.7(VEE) IC7.7(VEE) IC8.7(VEE) IC9.7(VEE) IC10.7(VEE) IC11.7(VEE) IC12.7(VEE) IC13.7(VEE) IC14.7(VEE) IC15.7(VEE) IC16.7(VEE) IC17.7(VEE) IC18.7(VEE) IC19.7(VEE) IC20.7(VEE) IC21.7(VEE) IC22.7(VEE) IC23.7(VEE) IC24.7(VEE) IC25.7(VEE) IC26.7(VEE) IC27.7(VEE) IC28.7(VEE) IC29.7(VEE) IC30.7(VEE) IC31.7(VEE) IC32.7(VEE) IC33.7(VEE) IC34.7(VEE) IC35.7(VEE) IC36.7(VEE)

## Library data of the parts
IC1-IC36 = 40xx:4051: 8-channel ANALOG MULTIPLEXER
R1-R210 = resistor:R-EU_: RESISTOR, European symbol